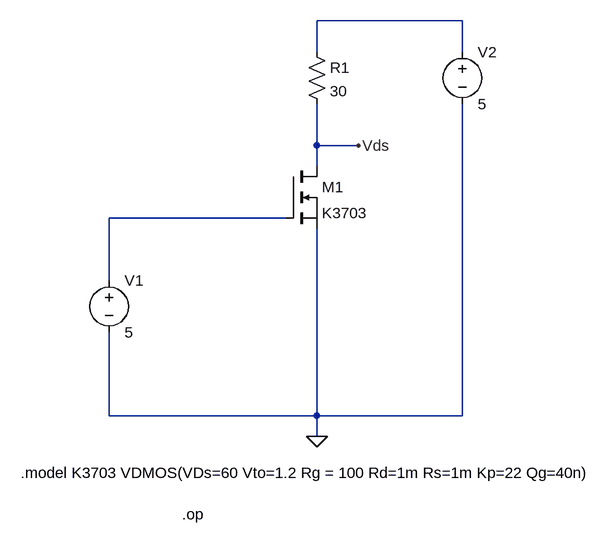
[diagram p0: schematic MOSFETSimu.asc]
MOSFETSimu.asc, the LTspice schematic file:
Version 4
SHEET 1 952 696
WIRE 736 -80 512 -80
WIRE 512 -32 512 -80
WIRE 736 -32 736 -80
WIRE 512 112 512 48
WIRE 576 112 512 112
WIRE 512 144 512 112
WIRE 464 224 192 224
WIRE 192 320 192 224
WIRE 192 528 192 400
WIRE 512 528 512 240
WIRE 512 528 192 528
WIRE 736 528 736 48
WIRE 736 528 512 528
WIRE 512 560 512 528
FLAG 512 560 0
FLAG 576 112 Vds
SYMBOL voltage 192 304 R0
SYMATTR InstName V1
SYMATTR Value 5
SYMBOL voltage 736 -48 R0
SYMATTR InstName V2
SYMATTR Value 5
SYMBOL nmos 464 144 R0
SYMATTR InstName M1
SYMATTR Value K3703
SYMBOL res 496 -48 R0
SYMATTR InstName R1
SYMATTR Value 30
TEXT 56 616 Left 2 !.model K3703 VDMOS(VDs=60 Vto=1.2 Rg = 100 Rd=1m Rs=1m Kp=22 Qg=40n)
TEXT 304 680 Left 2 !.op

The netlist it stands for:
* MOSFETSimu.asc
V1 N002 0 5
V2 N001 0 5
M1 Vds N002 0 0 K3703
R1 N001 Vds 30
.model NMOS NMOS
.model PMOS PMOS
.lib standard.mos
.model K3703 VDMOS(VDs=60 Vto=1.2 Rg = 100 Rd=1m Rs=1m Kp=22 Qg=40n)
.op
.backanno
.end